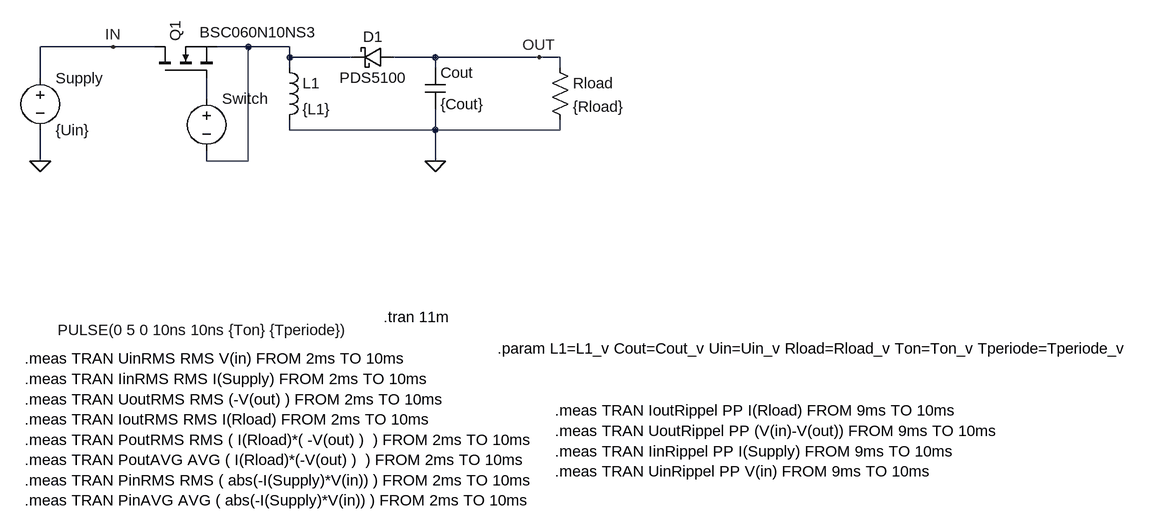
[diagram p0: schematic BuckBoostVariable.asc]
BuckBoostVariable.asc, the LTspice schematic file:
Version 4
SHEET 1 2836 1464
WIRE 1104 352 992 352
WIRE 1168 352 1104 352
WIRE 1312 352 1264 352
WIRE 1376 352 1312 352
WIRE 1376 368 1376 352
WIRE 1472 368 1376 368
WIRE 1600 368 1536 368
WIRE 1760 368 1600 368
WIRE 1792 368 1760 368
WIRE 1376 384 1376 368
WIRE 1600 384 1600 368
WIRE 1792 384 1792 368
WIRE 992 400 992 352
WIRE 1248 432 1248 400
WIRE 1376 480 1376 464
WIRE 1600 480 1600 448
WIRE 1600 480 1376 480
WIRE 1792 480 1792 464
WIRE 1792 480 1600 480
WIRE 992 528 992 480
WIRE 1248 528 1248 512
WIRE 1312 528 1312 352
WIRE 1312 528 1248 528
WIRE 1600 528 1600 480
FLAG 1760 368 OUT
FLAG 1104 352 IN
FLAG 992 528 0
FLAG 1600 528 0
SYMBOL nmos 1168 400 R270
WINDOW 3 71 69 VRight 2
SYMATTR InstName Q1
SYMATTR Value BSC060N10NS3
SYMBOL ind 1360 368 R0
SYMATTR InstName L1
SYMATTR Value {L1}
SYMATTR SpiceLine Ipk=16.7 Rser=0.0187 Rpar=3108.6 Cpar=0
SYMBOL schottky 1536 384 M270
WINDOW 0 32 32 VTop 2
WINDOW 3 0 32 VBottom 2
SYMATTR InstName D1
SYMATTR Value PDS5100
SYMATTR Description Diode
SYMATTR Type diode
SYMBOL cap 1584 384 R0
SYMATTR SpiceLine Rser=0.004
SYMATTR Value {Cout}
SYMATTR InstName Cout
SYMBOL res 1776 368 R0
SYMATTR InstName Rload
SYMATTR Value {Rload}
SYMBOL voltage 992 384 R0
WINDOW 123 0 0 Left 2
WINDOW 39 0 0 Left 2
SYMATTR InstName Supply
SYMATTR Value {Uin}
SYMBOL voltage 1248 416 R0
WINDOW 123 0 0 Left 2
WINDOW 39 0 0 Left 2
WINDOW 3 -229 372 Left 2
SYMATTR Value PULSE(0 5 0 10ns 10ns {Ton} {Tperiode})
SYMATTR InstName Switch
TEXT 1520 768 Left 2 !.tran 11m
TEXT 968 832 Left 2 !.meas TRAN UinRMS RMS V(in) FROM 2ms TO 10ms\n.meas TRAN IinRMS RMS I(Supply) FROM 2ms TO 10ms\n.meas TRAN UoutRMS RMS (-V(out) ) FROM 2ms TO 10ms\n.meas TRAN IoutRMS RMS I(Rload) FROM 2ms TO 10ms\n.meas TRAN PoutRMS RMS ( I(Rload)*( -V(out) )  ) FROM 2ms TO 10ms\n.meas TRAN PoutAVG AVG ( I(Rload)*(-V(out) )  ) FROM 2ms TO 10ms\n.meas TRAN PinRMS RMS ( abs(-I(Supply)*V(in)) ) FROM 2ms TO 10ms\n.meas TRAN PinAVG AVG ( abs(-I(Supply)*V(in)) ) FROM 2ms TO 10ms
TEXT 1784 912 Left 2 !.meas TRAN IoutRippel PP I(Rload) FROM 9ms TO 10ms\n.meas TRAN UoutRippel PP (V(in)-V(out)) FROM 9ms TO 10ms\n.meas TRAN IinRippel PP I(Supply) FROM 9ms TO 10ms\n.meas TRAN UinRippel PP V(in) FROM 9ms TO 10ms
TEXT 1696 816 Left 2 !.param L1=L1_v Cout=Cout_v Uin=Uin_v Rload=Rload_v Ton=Ton_v Tperiode=Tperiode_v

The netlist it stands for:
* BuckBoostVariable.asc
M§Q1 IN N002 N001 N001 BSC060N10NS3
L1 N001 0 {L1} Ipk=16.7 Rser=0.0187 Rpar=3108.6 Cpar=0
D1 OUT N001 PDS5100
Cout OUT 0 {Cout} Rser=0.004
Rload OUT 0 {Rload}
V§Supply IN 0 {Uin}
V§Switch N002 N001 PULSE(0 5 0 10ns 10ns {Ton} {Tperiode})
.model D D
.lib standard.dio
.model NMOS NMOS
.model PMOS PMOS
.lib standard.mos
.tran 11m
.meas TRAN UinRMS RMS V(in) FROM 2ms TO 10ms
.meas TRAN IinRMS RMS I(Supply) FROM 2ms TO 10ms
.meas TRAN UoutRMS RMS (-V(out) ) FROM 2ms TO 10ms
.meas TRAN IoutRMS RMS I(Rload) FROM 2ms TO 10ms
.meas TRAN PoutRMS RMS ( I(Rload)*( -V(out) )  ) FROM 2ms TO 10ms
.meas TRAN PoutAVG AVG ( I(Rload)*(-V(out) )  ) FROM 2ms TO 10ms
.meas TRAN PinRMS RMS ( abs(-I(Supply)*V(in)) ) FROM 2ms TO 10ms
.meas TRAN PinAVG AVG ( abs(-I(Supply)*V(in)) ) FROM 2ms TO 10ms
.meas TRAN IoutRippel PP I(Rload) FROM 9ms TO 10ms
.meas TRAN UoutRippel PP (V(in)-V(out)) FROM 9ms TO 10ms
.meas TRAN IinRippel PP I(Supply) FROM 9ms TO 10ms
.meas TRAN UinRippel PP V(in) FROM 9ms TO 10ms
.param L1=L1_v Cout=Cout_v Uin=Uin_v Rload=Rload_v Ton=Ton_v Tperiode=Tperiode_v
.backanno
.end